# Altium schematic sheet design.schdoc
size 249 x 126 mm
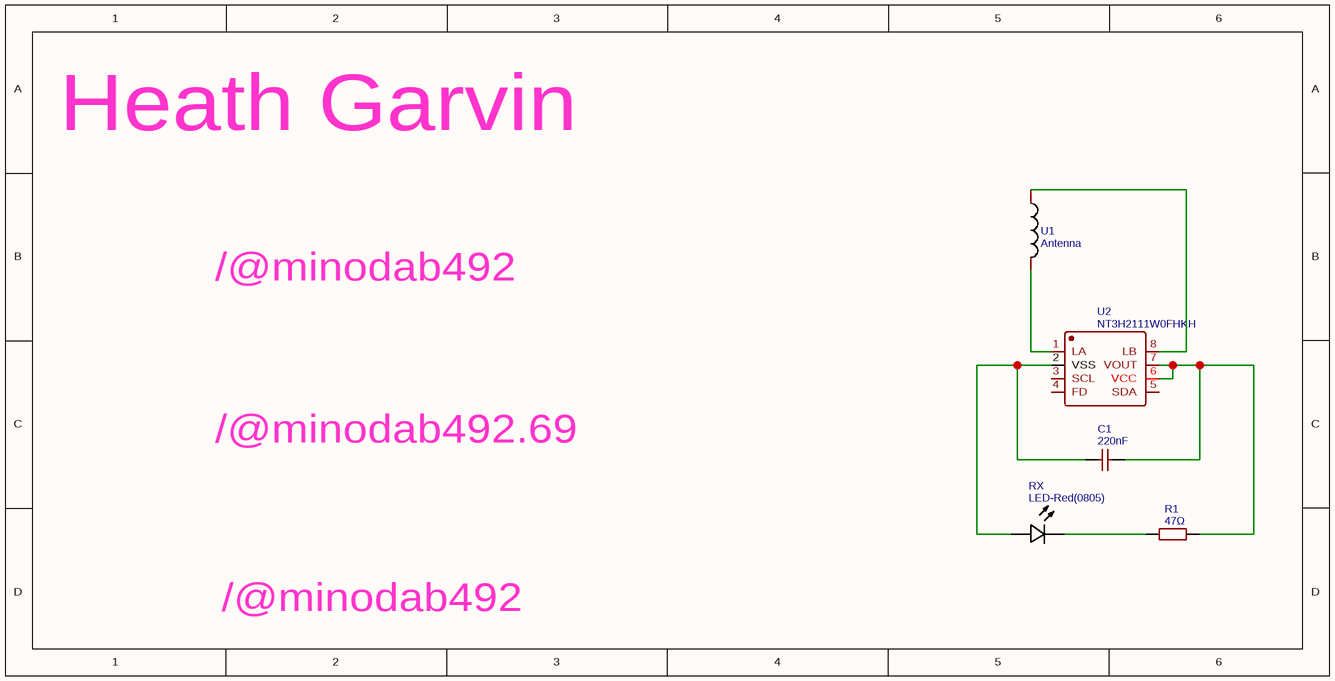
[diagram p0: design.schdoc]

## Parts
C1  220nF  [C0603]
R1  47Ω  [R0603]
RX  LED-Red(0805)  [LED-0805]
U1  Antenna  [25X48MM_NFC_ANTENNA]
U2  NT3H2111W0FHKH  [XQFN-8_L1.6-W1.6-P0.50-BL_NT3H2111W0FHKH]

## Nets
NetC1_1: C1.1 RX.1(+) U2.2(VSS)
NetC1_2: C1.2 R1.2 U2.6(VCC) U2.7(VOUT)
NetR1_1: R1.1 RX.2(-)
NetU1_P$1: U1.P$1 U2.1(LA)
NetU1_P$2: U1.P$2 U2.8(LB)

Not connected (* = marked no-connect by the designer): U2 3(SCL) 4(FD) 5(SDA)

## Notes on the sheet
- Heath Garvin
- /@minodab492
- /@minodab492.69

## Library data of the parts
C1 = 220nF: Manufacturer Part: CL10B224KA8NNNC; Manufacturer: SAMSUNG(三星); nameAlias: Value; Supplier: LCSC; Supplier Part: C21120; JLCPCB Part Class: Basic Part; spicePre: C; spiceSymbolName: CL10B224KA8NNNC
R1 = 47Ω: Manufacturer: UNI-ROYAL(厚声); Manufacturer Part: 0603WAF470JT5E; nameAlias: Value; Supplier: LCSC; Supplier Part: C23182; JLCPCB Part Class: Basic Part; spicePre: R; spiceSymbolName: 0603WAF470JT5E
RX = LED-Red(0805): Manufacturer: Hubei KENTO Elec; Manufacturer Part: 17-21SUYC/TR8; Contributor: pavol.machala; Supplier: LCSC; Supplier Part: C2296; spicePre: L; spiceSymbolName: LED-Red(0805)
U1 = Antenna: Contributor: maggie.j.liu; spicePre: U; spiceSymbolName: Antenna
U2 = NT3H2111W0FHKH: Manufacturer: NXP(恩智浦); Contributor: LCSC; Supplier: LCSC; Supplier Part: C710403; Manufacturer Part: NT3H2111W0FHKH; JLCPCB Part Class: Extended Part; spicePre: U; spiceSymbolName: NT3H2111W0FHKH